# EAGLE design needed-components (EAGLE 6.6.0)
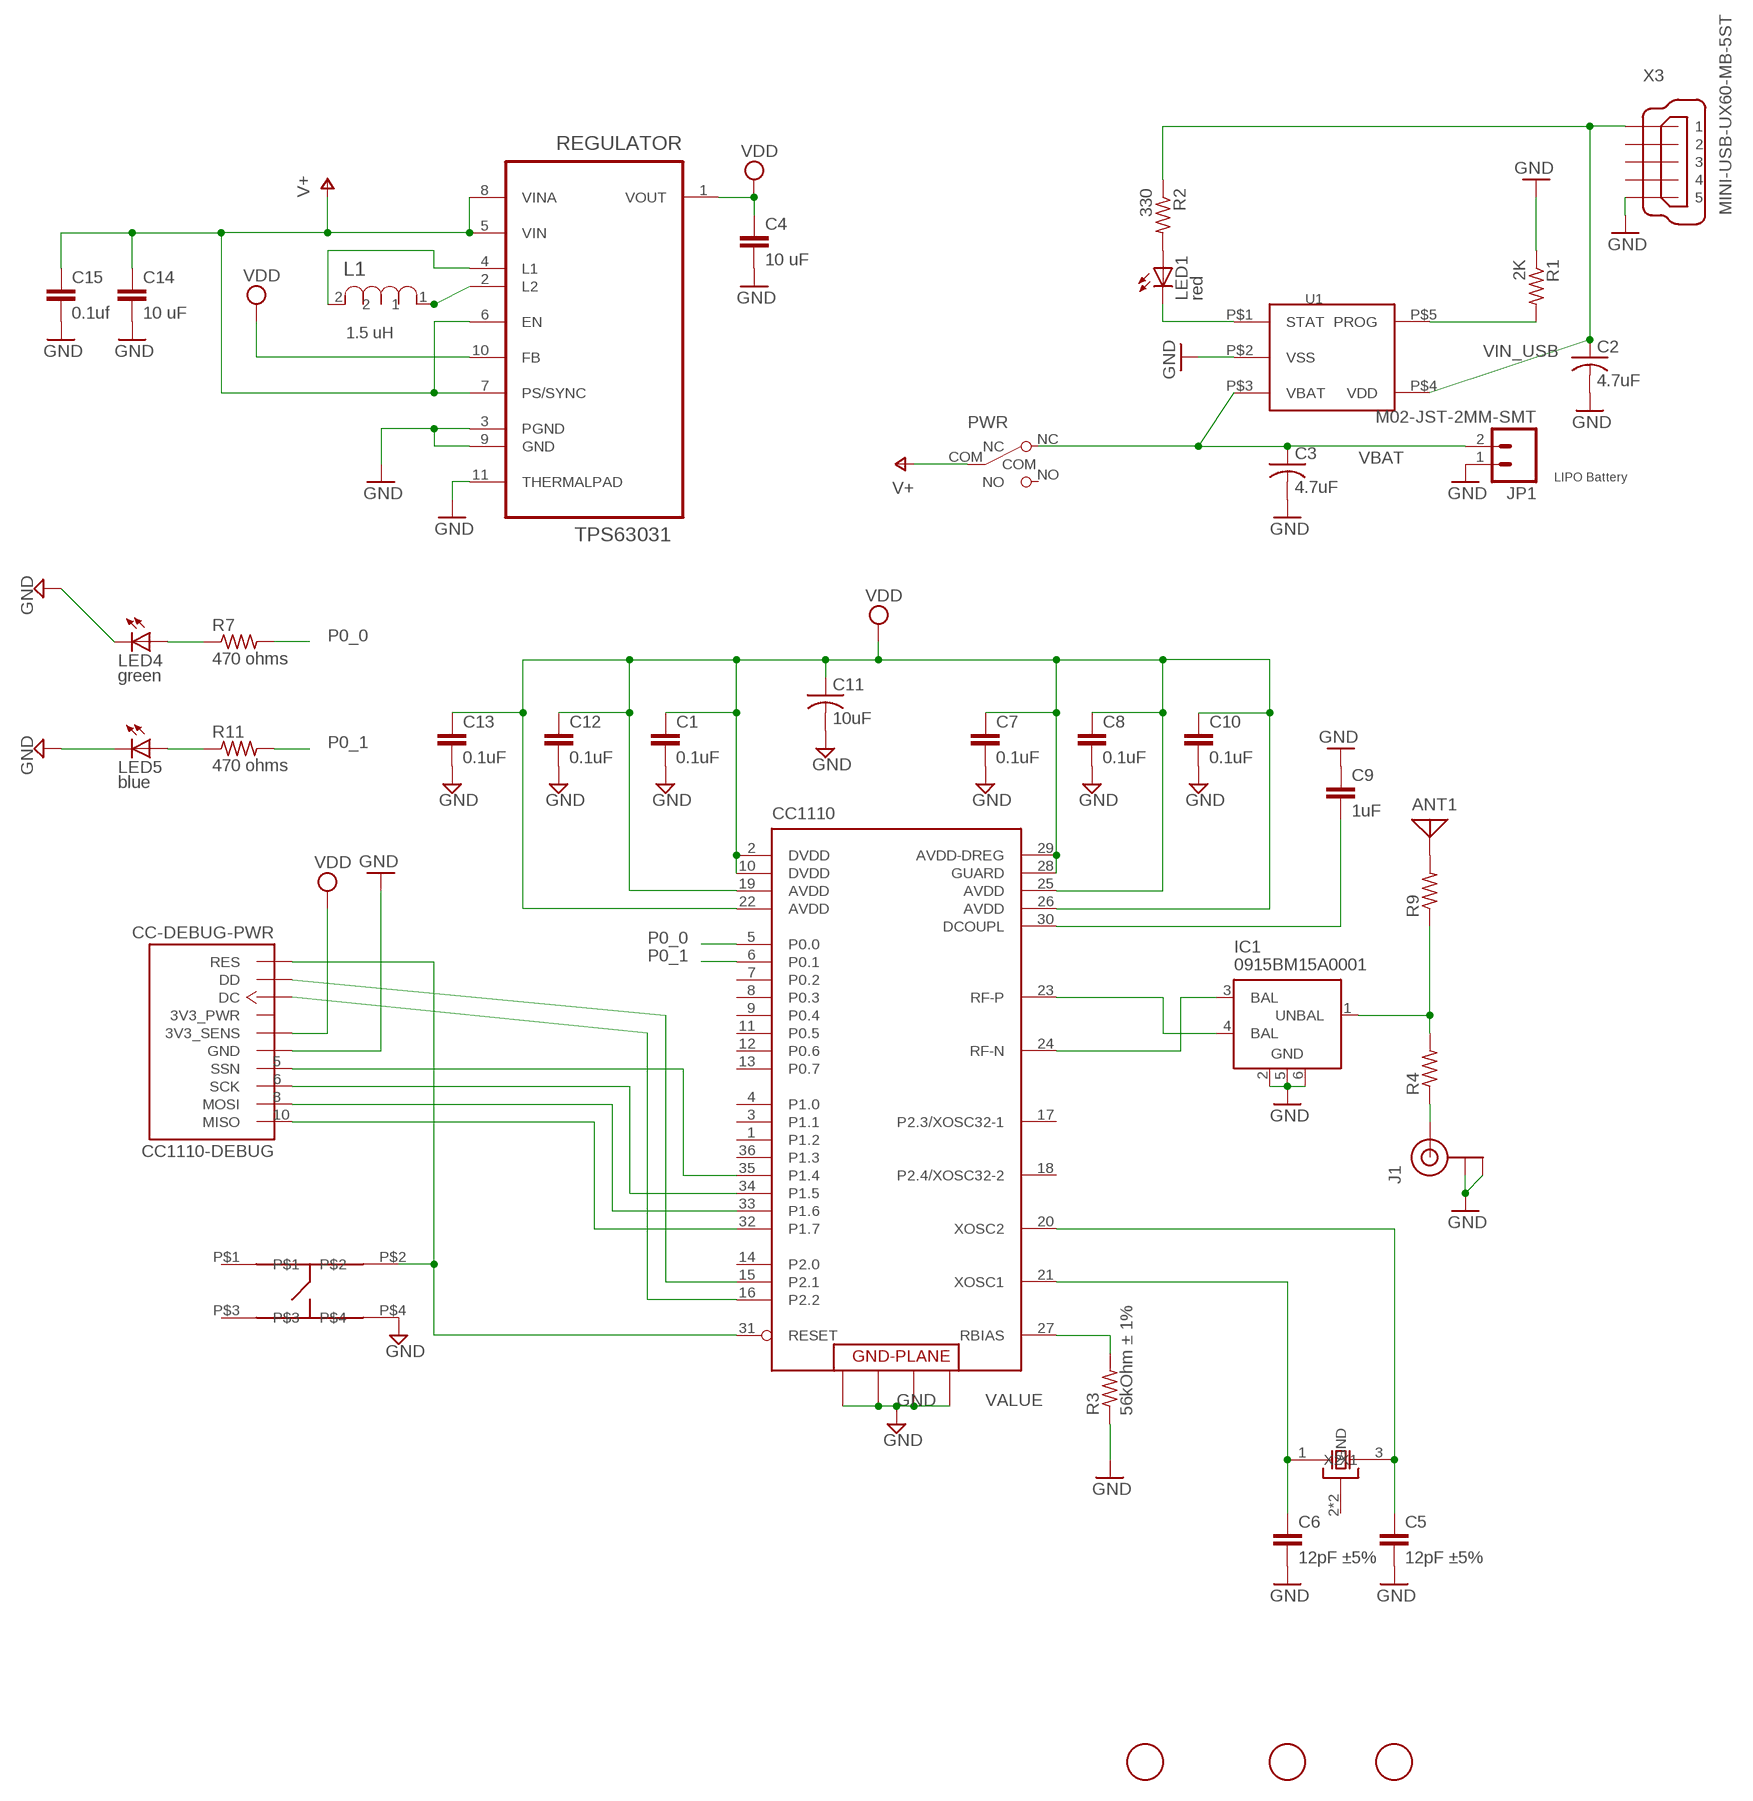
[diagram p0: schematic, sheet 1]

## Parts
ANT1  ANTENNA  [PAD-01]
C1  0.1uF  C-EUC0402  [C0402]
C2  4.7uF  C-USC0603K  [C0603K]
C3  4.7uF  C-USC0603K  [C0603K]
C4  10 uF  C-EUC0805K  [C0805K]
C5  12pF ±5%  C-EUC0402K  [C0402K]
C6  12pF ±5%  C-EUC0402K  [C0402K]
C7  0.1uF  C-EUC0402  [C0402]
C8  0.1uF  C-EUC0402  [C0402]
C9  1uF  C-EUC0402K  [C0402K]
C10  0.1uF  C-EUC0402  [C0402]
C11  10uF  C-USC0805K  [C0805K]
C12  0.1uF  C-EUC0402  [C0402]
C13  0.1uF  C-EUC0402  [C0402]
C14  10 uF  C-EUC0603  [C0603]
C15  0.1uf  C-EUC0402  [C0402]
CC1110  CC1110  [QLP-36_UPDATE]
CC1110-DEBUG  CC-DEBUG-PWR  [CC-P05]
FID1  FIDUCIAL  [FIDUCIAL_1MM]
FID2  FIDUCIAL  [FIDUCIAL_1MM]
FID3  FIDUCIAL  [FIDUCIAL_1MM]
IC1  0915BM15A0001  [0915BM15A0001]
J1  U.FL  [U.FL]
JP1  M02-JST-2MM-SMT  [JST-2-SMD]
L1  1.5 uH  PM0603-R12J-RC  [INDC1610X12N]
LED1  red  LEDSML0603  [SML0603]
LED4  green  LEDSML0603  [SML0603]
LED5  blue  LEDSML0603  [SML0603]
PWR  SW_SLIDE  [SLIDE_SWITCH_SMD]
R1  2K  R-US_R0402  [R0402]
R2  330  R-US_R0402  [R0402]
R3  56kOhm ± 1%  R-US_R0402  [R0402]
R4  R-US_R0402  [R0402]
R7  470 ohms  R-US_R0402  [R0402]
R9  R-US_R0402  [R0402]
R11  470 ohms  R-US_R0402  [R0402]
REGULATOR  TPS63031  [SON50P260X260X80-11N]
U1  MCP73831  [5PIN_SOT23]
U$2  TACTILE_SWITCH  [PTS540]
X1  24MHz 8pF 10ppm -20C +70C  CTS_32X25_SMD  [CTS_32X25]
X3  MINI-USB-UX60-MB-5ST  [UX60-MB-5ST]

## Nets
DC: CC1110-DEBUG.3(DC) CC1110.16(P2.2)
DD: CC1110-DEBUG.4(DD) CC1110.15(P2.1)
GND: C1.2 C2.2 C3.2 C4.2 C5.2 C6.2 C7.2 C8.2 C9.1 C10.2 C11.2 C12.2 C13.2 C14.2 C15.2 CC1110-DEBUG.1(GND) CC1110.37(GND) CC1110.38(GND) CC1110.39(GND) CC1110.40(GND) IC1.2(GND) IC1.5(GND) IC1.6(GND) J1.P$1(GND) J1.P$2(GND) JP1.1 LED4.C LED5.C R1.1 R3.1 REGULATOR.3(PGND) REGULATOR.9(GND) REGULATOR.11(THERMALPAD) U1.P$2(VSS) U$2.P$4 X3.5
MISO: CC1110-DEBUG.10(MISO) CC1110.32(P1.7)
MOSI: CC1110-DEBUG.8(MOSI) CC1110.33(P1.6)
N$1: L1.1 REGULATOR.2(L2)
N$2: LED1.C U1.P$1(STAT)
N$3: R1.2 U1.P$5(PROG)
N$4: LED1.A R2.2
N$5: CC1110.24(RF-N) IC1.3(BAL)
N$6: L1.2 REGULATOR.4(L1)
N$7: CC1110.23(RF-P) IC1.4(BAL)
N$9: J1.P$3(SIGNAL) R4.1
N$10: IC1.1(UNBAL) R4.2 R9.1
N$12: ANT1.1 R9.2
N$14: CC1110.27(RBIAS) R3.2
N$18: C9.2 CC1110.30(DCOUPL)
N$20: C6.1 CC1110.21(XOSC1) X1.1(X1)
N$21: C5.1 CC1110.20(XOSC2) X1.3(X2)
N$24: LED4.A R7.1
N$25: LED5.A R11.1
P0_0: CC1110.5(P0.0) R7.2
P0_1: CC1110.6(P0.1) R11.2
RESET: CC1110-DEBUG.7(RES) CC1110.31(RESET) U$2.P$2
SCK: CC1110-DEBUG.6(SCK) CC1110.34(P1.5)
SSN: CC1110-DEBUG.5(SSN) CC1110.35(P1.4)
V+: C14.1 C15.1 PWR.COM REGULATOR.5(VIN) REGULATOR.6(EN) REGULATOR.7(PS/SYNC) REGULATOR.8(VINA)
VBAT: C3.1 JP1.2 PWR.NC U1.P$3(VBAT)
VDD: C1.1 C4.1 C7.1 C8.1 C10.1 C11.1 C12.1 C13.1 CC1110-DEBUG.2(3V3_SENS) CC1110.2(DVDD) CC1110.10(DVDD) CC1110.19(AVDD) CC1110.22(AVDD) CC1110.25(AVDD) CC1110.26(AVDD) CC1110.28(GUARD) CC1110.29(AVDD-DREG) REGULATOR.1(VOUT) REGULATOR.10(FB)
VIN_USB: C2.1 R2.1 U1.P$4(VDD) X3.1
Unconnected: CC1110-DEBUG.9(3V3_PWR) CC1110.1(P1.2) CC1110.3(P1.1) CC1110.4(P1.0) CC1110.7(P0.2) CC1110.8(P0.3) CC1110.9(P0.4) CC1110.11(P0.5) CC1110.12(P0.6) CC1110.13(P0.7) CC1110.14(P2.0) CC1110.17(P2.3/XOSC32-1) CC1110.18(P2.4/XOSC32-2) CC1110.36(P1.3) PWR.NO U$2.P$1 U$2.P$3 X3.2 X3.3 X3.4

## Notes on the sheet
- LIPO Battery

## Power pins joined to a net without a drawn wire
GND: X1.2(GND) X1.4(GND)

## Library data of the parts
ANT1 = discrete:ANTENNA: Antenna
C1 C4-C10 C12-C15 = rcl:C-EU: CAPACITOR
C2 C3 C11 = rcl:C-US: CAPACITOR, American symbol
CC1110 = board:CC1110: True System-on-Chip with Low Power RF Transceiver and 8051 MCU
CC1110-DEBUG = parts:CC-DEBUG-PWR: CC debugger connection with various form factors. 2x5-pin 0.05" pitch header include Pin 9 (VDD) supply connection as separate pin. https://github.com/jrowberg/sf-oshw Last updated 2014-01-04 by Jeff Rowberg <jeff@rowberg.net>
FID1-FID3 = adafruit:FIDUCIAL: For use by pick and place machines to calibrate the vision/machine, 1mm By microbuilder.eu
IC1 = parts:0915BM15A0001: 915 MHz Impedance Matched Balun-Filter For TI CC11xx Chipset family Data sheet <http://www.johansontechnology.com/datasheets/chipset-specific/0915BM15A0001.pdf>
J1 = SparkFun-Connectors:U.FL: SMD antenna connector- WRL-09144; PROD_ID: CONN-09193
JP1 = SparkFun-Connectors:M02: Standard 2-pin 0.1" header. Use with - straight break away headers ( PRT-00116) - right angle break away headers (PRT-00553) - swiss pins (PRT-00743) - machine pins (PRT-00117) - female headers (PRT-00115) Molex polarized connector foot print use with: PRT-08233 with associated crimp pins and housings. 2.54_SCREWTERM for use with PRT-10571. 3.5mm Screw Terminal footprints for PRT-08084 5mm Screw Terminal footprints for use with PRT-08432; PROD_ID: CONN-08352
L1 = Bourns_By_element14_Batch_1:PM0603-R12J-RC: CHIP INDUCTOR, 120NH, 300MA, 5%, 1300MHZ; MPN: MLF1608A1R5KTD25; SUPPLIER: Mouser; TOLERANCE: ±5 %; VALUE: 120 nH
LED1 LED4 LED5 = led:LED: LED OSRAM: - CHIPLED LG R971, LG N971, LY N971, LG Q971, LY Q971, LO R971, LY R971 LH N974, LH R974 LS Q976, LO Q976, LY Q976 LO Q996 - Hyper CHIPLED LW Q18S LB Q993, LB Q99A, LB R99A - SideLED LS A670, LO A670, LY A670, LG A670, LP A670 LB A673, LV A673, LT A673, LW A673 LH A674 LY A675 LS A676, LA A676, LO A676, LY A676, LW A676 LS A679, LY A679, LG A679 - Hyper Micro SIDELED® LS Y876, LA Y876, LO Y876, LY Y876 LT Y87S - SmartLED LW L88C, LW L88S LB L89C, LB L89S, LG L890 LS L89K, LO L89K, LY L89K LS L896, LA L896, LO L896, LY L896 - TOPLED LS T670, LO T670, LY T670, LG T670, LP T670 LSG T670, LSP T670, LSY T670, LOP T670, LYG T670 LG T671, LOG T671, LSG T671 LB T673, LV T673, LT T673, LW T673 LH T674 LS T676, LA T676, LO T676, LY T676, LB T676, LH T676, LSB T676, LW T676 LB T67C, LV T67C, LT T67C, LS T67K, LO T67K, LY T67K, LW E67C LS E67B, LA E67B, LO E67B, LY E67B, LB E67C, LV E67C, LT E67C LW T67C LS T679, LY T679, LG T679 LS T770, LO T770, LY T770, LG T770, LP T770 LB T773, LV T773, LT T773, LW T773 LH T774 LS E675, LA E675, LY E675, LS T675 LS T776, LA T776, LO T776, LY T776, LB T776 LHGB T686 LT T68C, LB T68C - Hyper Mini TOPLED® LB M676 - Mini TOPLED Santana® LG M470 LS M47K, LO M47K, LY M47K Source: http://www.osram.convergy.de LUXEON: - LUMILED® LXK2-PW12-R00, LXK2-PW12-S00, LXK2-PW14-U00, LXK2-PW14-V00 LXK2-PM12-R00, LXK2-PM12-S00, LXK2-PM14-U00 LXK2-PE12-Q00, LXK2-PE12-R00, LXK2-PE12-S00, LXK2-PE14-T00, LXK2-PE14-U00 LXK2-PB12-K00, LXK2-PB12-L00, LXK2-PB12-M00, LXK2-PB14-N00, LXK2-PB14-P00, LXK2-PB14-Q00 LXK2-PR12-L00, LXK2-PR12-M00, LXK2-PR14-Q00, LXK2-PR14-R00 LXK2-PD12-Q00, LXK2-PD12-R00, LXK2-PD12-S00 LXK2-PH12-R00, LXK2-PH12-S00 LXK2-PL12-P00, LXK2-PL12-Q00, LXK2-PL12-R00 Source: www.luxeon.com KINGBRIGHT: KA-3528ASYC Source: www.kingbright.com
PWR = parts:SW_SLIDE
R1-R4 R7 R9 R11 = rcl:R-US_: RESISTOR
REGULATOR = board:TPS63031: HIGH EFFICIENCY SINGLE INDUCTOR BUCK-BOOST CONVERTER WITH 1-A SWITCHES; MPN: TPS63031; OC_FARNELL: 1686303; OC_NEWARK: 19P7478; PACKAGE: SON-10; SUPPLIER: Texas Instruments
U1 = parts:MCP73831: Digikey No:- __MCP73831T-2ACI/OTCT-ND__
U$2 = parts:TACTILE_SWITCH: Ultra Low Profile SMT Top Actuated PTS540 JM035 SMTR LFS Datasheet <http://www.mouser.com/ds/2/60/PTS540_9sept14-372441.pdf>
X1 = cts_crystal:CTS_32X25_SMD
X3 = con-hirose:MINI-USB-: MINI USB Connector Source: http://www.hirose.co.jp/cataloge_hp/e24000019.pdf; OC_FARNELL: unknown; OC_NEWARK: unknown

## Board
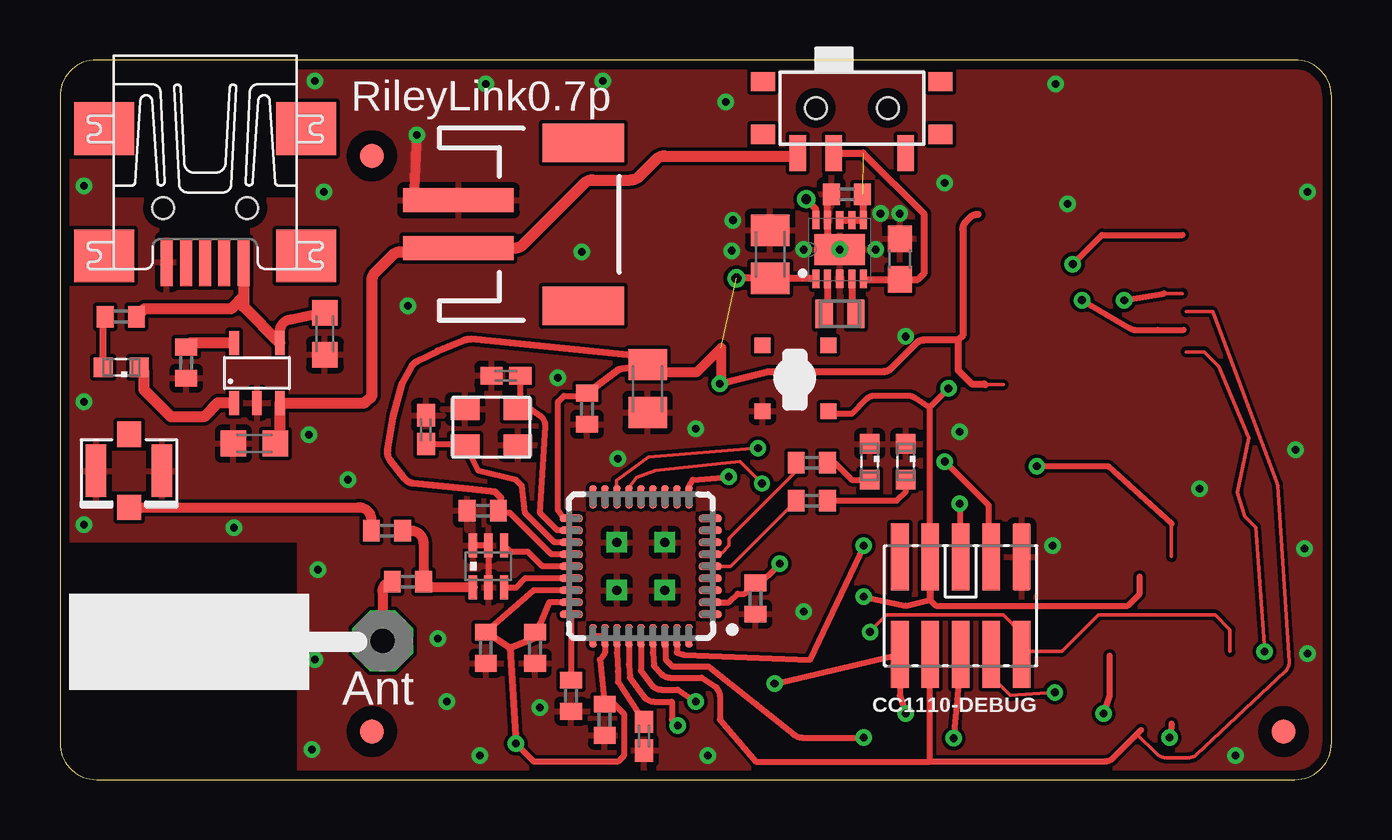
[diagram p1: board, top side]
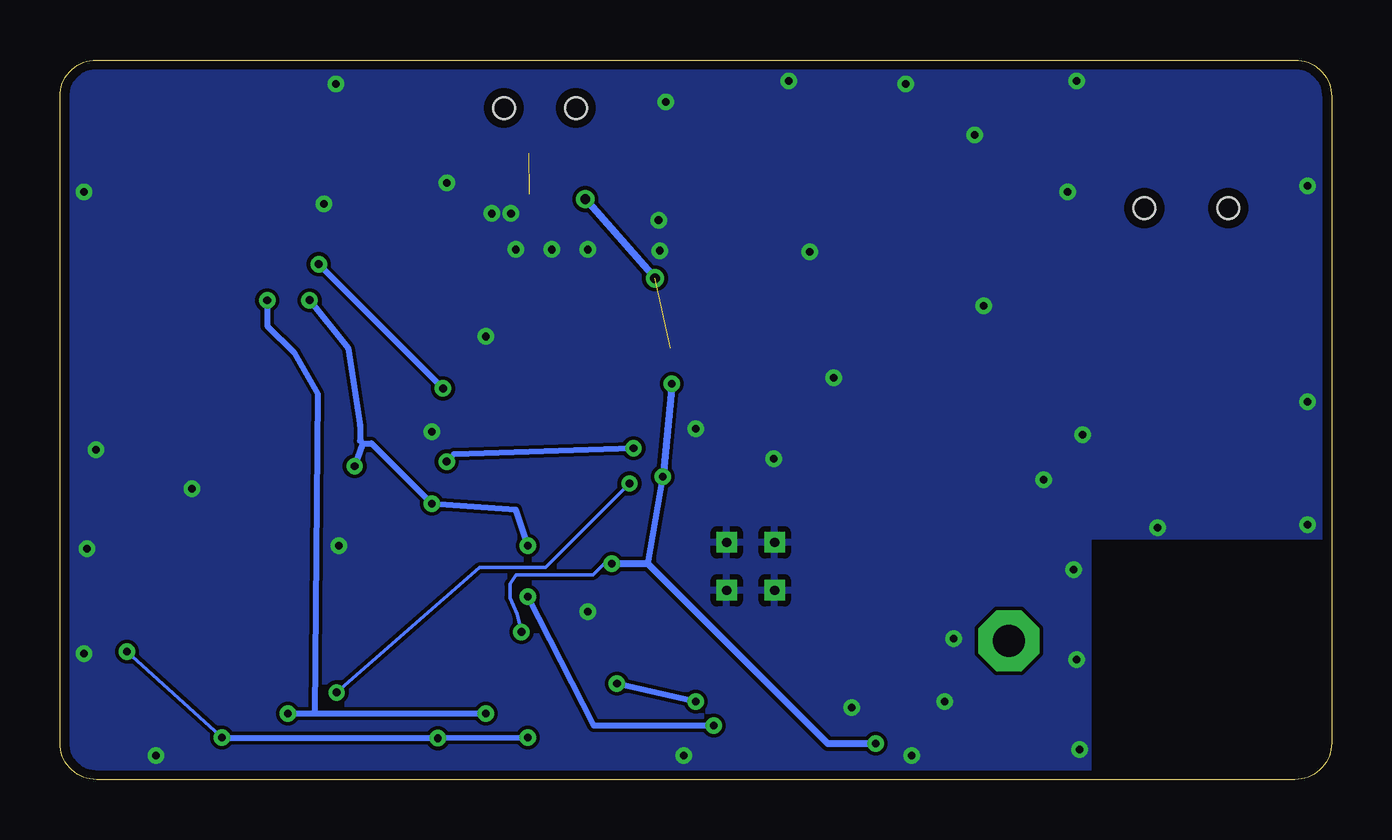
[diagram p2: board, bottom side, seen from below]

Size 53 x 30 mm. Coordinates in mm from the lower left corner, seen from the top.
Outline: 0,28.48 0,1.52 arc90 1.52,0 51.48,0 arc90 53,1.52 53,28.48 arc90 51.48,30 1.52,30 arc90 0,28.48
Copper layers (1*16): Top 0.0356mm / dielectric 1.5011mm / Bottom 0.0356mm
Design rules "oshpark *": minimum track width 6mil, minimum drill 13mil, track to track 6mil, track to pad 6mil, pad to pad 6mil, via to via 6mil, smd to smd 6mil, copper to edge 15mil, drill to drill 6mil, minimum pad ring 7mil, minimum via ring 7mil, stop-mask expansion 3mil, vias tented up to drill 21mil, thermal gap 10mil
bRestrict: area 0,0 to 10,10

### Footprints (pad centres in the part's own frame; a part is rotated, then mirrored left to right if it is on the bottom)
PAD-01 = drill 1.321 pad 2.54 octagon: 1 0,0
C0402 = smd 0.7 x 0.9: 1 -0.65,0; 2 0.65,0
C0603K = smd 1.05 x 1.08: 1 -0.875,0; 2 0.875,0
C0805K = smd 1.3 x 1.6: 1 -1,0; 2 1,0
C0402K = smd 0.925 x 0.74: 1 -0.6,0; 2 0.6,0
C0603 = smd 1.1 x 1: 1 -0.85,0; 2 0.85,0
QLP-36_UPDATE = smd 0.95 x 0.3: 1 -2.9,2; 2 -2.9,1.5; 3 -2.9,1; 4 -2.9,0.5; 5 -2.9,0; 6 -2.9,-0.5; 7 -2.9,-1; 8 -2.9,-1.5; 9 -2.9,-2; 19 2.9,-2; 20 2.9,-1.5; 21 2.9,-1; 22 2.9,-0.5; 23 2.9,0; 24 2.9,0.5; 25 2.9,1; 26 2.9,1.5; 27 2.9,2 | smd 0.3 x 0.95: 10 -2,-2.9; 11 -1.5,-2.9; 12 -1,-2.9; 13 -0.5,-2.9; 14 0,-2.9; 15 0.5,-2.9; 16 1,-2.9; 17 1.5,-2.9; 18 2,-2.9; 28 2,2.9; 29 1.5,2.9; 30 1,2.9; 31 0.5,2.9; 32 0,2.9; 33 -0.5,2.9; 34 -1,2.9; 35 -1.5,2.9; 36 -2,2.9 | drill 0.381 pad 0.85 square: 37 -1,1; 38 1,1; 39 -1,-1; 40 1,-1
CC-P05 = smd 0.74 x 2.8: 1 -2.54,-2.03; 2 -2.54,2.03; 3 -1.27,-2.03; 4 -1.27,2.03; 5 0,-2.03; 6 0,2.03; 7 1.27,-2.03; 8 1.27,2.03; 9 2.54,-2.03; 10 2.54,2.03
FIDUCIAL_1MM = smd 1 x 1: 1 0,0
0915BM15A0001 = smd 0.35 x 1: 1 -0.65,-0.875; 2 0,-0.875; 3 0.65,-0.875; 4 0.65,0.875; 5 0,0.875; 6 -0.65,0.875
U.FL = smd 2.2 x 0.85: P$1 0,1.375; P$2 0,-1.375 | smd 1.05 x 1: P$3 1.525,0; P$4 -1.525,0
JST-2-SMD = smd 1 x 4.6: 1 -1,-3.7; 2 1,-3.7 | smd 1.6 x 3.4: NC1 -3.4,1.5; NC2 3.4,1.5
INDC1610X12N = smd 0.711 x 1.194: 1 -0.66,0; 2 0.66,0
SML0603 = smd 0.8 x 0.8: A 0.75,0; C -0.75,0
SLIDE_SWITCH_SMD = smd 0.7 x 1.5: COM 0.75,1.875; NC 2.25,1.875; NO -2.25,1.875 | smd 1 x 0.8: P$1 -3.7,-1.1; P$2 -3.7,1.1; P$3 3.7,1.1; P$4 3.7,-1.1 | hole 0.9: -1.5,0; 1.5,0
R0402 = smd 0.7 x 0.9: 1 -0.65,0; 2 0.65,0
SON50P260X260X80-11N = smd 0.762 x 0.305: 1 -1.219,0.991; 2 -1.219,0.508; 3 -1.219,0; 4 -1.219,-0.508; 5 -1.219,-0.991; 6 1.219,-0.991; 7 1.219,-0.508; 8 1.219,0; 9 1.219,0.508; 10 1.219,0.991 | smd 1.295 x 2.108: 11 0,0
5PIN_SOT23 = smd 0.4 x 1: P$1 0.4,-0.63; P$2 1.35,-0.63; P$3 2.3,-0.63; P$4 2.3,1.87; P$5 0.4,1.87
PTS540 = smd 0.65 x 0.65: P$1 -1.375,1.375; P$2 1.375,1.375; P$3 -1.375,-1.375; P$4 1.375,-1.375
CTS_32X25 = smd 1.2 x 0.9: 1 -1.1,-0.7; 2 1.1,-0.7; 3 1.1,0.8; 4 -1.1,0.8
UX60-MB-5ST = smd 2 x 0.5: 1 2.25,1.6; 2 2.25,0.8; 3 2.25,0; 4 2.25,-0.8; 5 2.25,-1.6 | smd 2.2 x 2.5: M1 -3.3,-4.2; M2 -3.3,4.2; M3 2,4.2; M4 2,-4.2 | hole 0.9: 0,-1.75; 0,1.75

### Placement (x,y rotation side)
ANT1  13.45,5.78 0 top
C1  28.99,7.55 270 top
C2  11.04,18.59 270 top
C3  8.1,14.01 180 top
C4  29.6,21.9 90 top
C5  18.59,16.84 180 top
C6  15.26,14.59 90 top
C7  22.7,2.5 270 top
C8  17.75,5.5 270 top
C9  24.34,1.81 90 top
C10  19.8,5.5 270 top
C11  24.5,16.3 270 top
C12  21.97,15.46 270 top
C13  17.62,11.21 180 top
C14  35,21.7 90 top
C15  32.8,24.4 180 top
CC1110  24.21,8.89 180 top
CC1110-DEBUG  37.55,7.25 180 top
FID1  13,2 0 top
FID2  13,26 0 top
FID3  51,2 0 top
IC1  17.86,8.89 0 top
J1  2.88,12.88 270 top
JP1  20.31,23.15 270 top
L1  32.52,19.42 0 top
LED1  2.55,17.19 180 top
LED4  35.25,13.25 270 top
LED5  33.75,13.25 270 top
PWR  33,28 180 top
R1  5.26,17.38 90 top
R2  2.54,19.3 180 top
R3  21.3,3.5 90 top
R4  13.62,10.38 0 top
R7  31.34,11.63 180 top
R9  14.5,8.25 180 top
R11  31.34,13.21 180 top
REGULATOR  32.5,22.1 90 top
U1  6.86,16.33 0 top
U$2  30.66,16.73 270 top
X1  17.98,14.64 0 top
X3  6.05,23.83 270 top

### Tracks (layer width: path | path; a pad name or v marks a point on that pad's centre or on a via)
DC  (via drill 0.33)
  Top 0.152: v29.09,13.81 24.54,13.44 23.19,12.47 23.19,12.14 CC1110.16 | 38.71,9.3 CC1110-DEBUG.3
  Top 0.24: v36.88,13.26 38.71,11.43 38.71,9.3
  Bottom 0.152: v36.88,13.26 36.58,13.56
  Bottom 0.24: 36.58,13.56 v29.09,13.81
DD  (via drill 0.33)
  Top 0.152: v29.26,12.34 28.35,13.26 24.81,12.88 24.02,12.59 23.77,12.26 CC1110.15 | v41.47,3.63 39.62,3.5 38.86,4.27 38.86,5.18 CC1110-DEBUG.4
  Bottom 0.152: v29.26,12.34 32.77,8.84 35.51,8.84 v41.47,3.63
GND  (via drill 0.33, 0.33 pad 0.41)
  Top 0.26: C10.2 20,5 | IC1.2 IC1.5 IC1.6
  Top 0.3: REGULATOR.11 31.99,22.1 REGULATOR.9 31.99,24.4 C15.2
  Top 0.406: JP1.1 14.75,24.15 v14.88,26.88
  other vias: 10.75,8.75 11,24.5 28,22.05 27.75,28.25 34,22.1 52,24.5 21.75,22 51.88,9.62 52,5.25 51.5,13.75 49,1 41.38,9.75 20.75,16.75 10.38,14.38 14.5,19.75 10.62,5 15.75,5.88 17.5,1 12,12.5 41.5,29 42,24 31,7 20,3 27,1 47.5,12.12 37.5,14.5 35.25,18.48 1,10.62 7.25,10.5 1,15.75 1,24.75 36.88,24.88 22.62,29.12 17.75,29 10.62,29.12 10.5,1.25 16.12,3.25 23.25,13.38 26.5,14.62 28.05,23.32 32.5,22.1 31,22.1 34.2,23.6 35,23.6
  pour Bottom: 0,30 53,30 53,0 0,0
  pour Top: 10,0 10,10 0,10 0,30 53,30 53,0
MISO  (via drill 0.33)
  Top 0.152: 46.02,20.27 46.79,20.27
  Top 0.24: CC1110.32 24.21,4.54 24.65,3.95 arc53 25.05,3.75 25.75,3.75 v26.5,3.25 | v29.79,4 CC1110-DEBUG.10 35.01,3.5 v35.25,2.75 | v43.5,2.75 43.75,3.5 43.75,5.17 | v44.36,19.98 46.02,20.27
  Bottom 0.152: 42.37,2.74 42.37,2.75
  Bottom 0.24: v26.5,3.25 v29.79,4 | v35.25,2.75 42.37,2.75 | 42.37,2.75 v43.5,2.75 | 42.37,2.75 42.24,16.05 43.25,17.8
  Bottom 0.254: v44.36,19.98 44.36,18.91 43.25,17.8
MOSI
  Top 0.152: 46.94,19.51 48.05,19.51 50.72,12.38 arc-17 50.75,12.23 51.23,4.91 arc-51 51.07,4.5 47.39,1.05 arc-43 47.04,0.91 46.08,0.91 arc-45 45.72,1.06 44.89,1.89
  Top 0.24: CC1110.33 24.71,5.29 24.75,4.75 25.05,4.42 arc48 25.43,4.25 26.75,4.25 27.27,3.9 arc-56 27.5,3.48 27.5,2.5 29,0.75 36.25,0.75 | 36.25,0.75 36.25,4.45 CC1110-DEBUG.8 | 45.07,2.07 44.89,1.89 43.9,0.9 arc-45 43.54,0.75 36.25,0.75
N$1
  Top 0.24: 31.99,19.56 L1.1
  Top 0.3: REGULATOR.2 31.99,19.56
N$2
  Top 0.45: U1.P$1 6.58,15.7 6,15.12 4.62,15.12 3.5,16.25 3.5,16.99 LED1.C
N$3
  Top 0.45: U1.P$5 5.43,18.2 R1.2
N$4
  Top 0.3: LED1.A 1.8,19.21 R2.2
N$5
  Top 0.26: CC1110.24 19.39,8.39 19,8 18.52,8 IC1.3
N$6
  Top 0.24: REGULATOR.4 33.01,21.09 33,21.1 | 33,19.59 L1.2
  Top 0.3: 33,21.1 33,19.59
N$7
  Top 0.26: CC1110.23 20.11,8.89 19.5,9.5 18.77,9.5 IC1.4
N$9
  Top 0.406: J1.P$3 12.47,11.35 arc-90 12.97,10.84 R4.1
N$10
  Top 0.24: 17.25,7.97 IC1.1 17.2,8
  Top 0.406: IC1.1 15.38,8.02 arc-90 R9.1 15.15,9.87 arc90 14.64,10.38 R4.2
N$12
  Top 0.406: R9.2 arc90 13.45,7.84 ANT1.1
N$14
  Top 0.26: CC1110.27 21.31,5 R3.2
N$18
  Top 0.26: CC1110.30 23.21,5.29 23.25,4.5 23.25,4.07 C9.2
N$20
  Top 0.24: CC1110.21 20.61,9.89 19.38,11.12 19.25,12.25 19,12.5 17.45,12.88 X1.1 16.84,13.98 C6.1
N$21
  Top 0.24: CC1110.20 20.73,10.39 20,11.12 20.23,14.72 arc58 20.02,15.16 19.38,15.62 19,15.62 19.08,15.54 19.18,15.54 | C5.1 19.18,15.54 | 19.18,15.54 X1.3
N$24
  Top 0.24: R7.1 34.88,11.63 35.25,12 LED4.A
N$25
  Top 0.24: R11.1 32.3,13.21 33,12.5 LED5.A
P0_0
  Top 0.152: CC1110.5 27.95,8.89 R7.2
P0_1
  Top 0.152: R11.2 30.63,13.11 30.63,12.8 27.89,10.06 27.89,9.75 27.58,9.45 27.13,9.45 CC1110.6
RESET  (via drill 0.33)
  Top 0.152: 36.27,15.54 36.25,15.5
  Top 0.24: CC1110.31 23.71,4.79 23.75,4.25 24.35,3.45 arc53 24.75,3.25 25.5,3.25 25.5,2.5 v25.75,2.25 | v33.5,7.62 35.25,7.25 36.25,7.5 36.25,8.64 | 36.25,8.64 CC1110-DEBUG.7 36.27,7.47 36.5,7.25 44.5,7.25 45,7.75 45,8.46 | 36.25,8.64 36.25,15.5 35.63,15.91 arc34 35.35,16 33.96,16 arc45 33.6,15.85 33,15.25 32.14,15.25 U$2.P$2 | 46.79,22.71 43.43,22.71 v42.22,21.49 | 36.27,15.54 v37.03,16.31
  Bottom 0.24: v25.75,2.25 30.75,2.25 v33.5,7.62 | v37.03,16.31 v42.22,21.49
SCK  (via drill 0.33)
  Top 0.152: 46.94,17.83 47.7,17.83 48.31,17.22 49.56,14.23 49.07,11.97 49.38,10.97 49.84,10.52 v50.21,5.33
  Top 0.24: 25.21,5.54 CC1110.34 25.25,5.95 25.25,5 25.55,4.7 27.05,4.7 30.61,1.86 arc39 30.93,1.75 v33.5,1.75 | v37.25,1.72 37.5,4.42 CC1110-DEBUG.6 | 46.34,2.34 v46.25,1.75
  Bottom 0.152: v50.21,5.33 46.33,1.83 v46.25,1.75
  Bottom 0.24: v33.5,1.75 v37.25,1.72 37.47,1.75 v46.25,1.75
SSN  (via drill 0.33)
  Top 0.152: 46.33,10.67 46.33,9.3
  Top 0.24: CC1110.35 25.71,5.29 26,5.2 31.25,5 v33.5,9.75 | v37.5,11.5 37.5,8.57 CC1110-DEBUG.5 | 46.33,10.67 43.68,13.06 v40.72,13.06 | v42.6,19.98 44.61,18.8 arc31 44.88,18.74 45.75,18.75 46.83,18.75
  Bottom 0.152: 37.64,11.58 v37.5,11.5
  Bottom 0.24: v33.5,9.75 34,11.25 v37.5,11.5 40.02,14.02 40.39,14.02 | 40.39,14.02 v40.72,13.06 | v42.6,19.98 40.98,17.98 40.5,14.75 40.5,14.13 40.39,14.02
V+  (1 unrouted)
  Top 0.3: REGULATOR.5 33.49,20.85 C14.1 35.75,20.85 36,21.1 36,23.6 33.48,26.12 PWR.COM | REGULATOR.8 REGULATOR.7 REGULATOR.6 33.49,24.4 C15.1
VBAT
  Top 0.3: 30.62,26 PWR.NC
  Top 0.45: C3.1 9.16,14.19 U1.P$3 12.7,15.7 13,16 13,20.79 arc-45 13.15,21.15 13.85,21.85 arc-45 14.21,22 16.46,22 JP1.2 18.94,22.15 arc45 19.3,22.3 21.85,24.85 arc-45 22.21,25 23.79,25 arc45 24.15,25.15 24.85,25.85 arc-45 25.21,26 30.62,26
VDD  (via drill 0.33, 0.41)  (1 unrouted)
  Top 0.152: 48.77,5.33 48.77,6.25 48.16,6.86 43.28,6.86 41.76,5.33 40.23,5.33 CC1110-DEBUG.2 40.08,5.33 40.08,6.1 39.32,6.86 34.44,6.86 34.14,6.55 v33.76,6.15 | 38.56,16.46 39.32,16.46
  Top 0.24: v30,9 28.95,7.95 C1.1 28.54,7.75 28.25,7.75 27.89,7.39 CC1110.2 | 23.5,2.75 23.5,1 23.25,0.75 19.75,0.75 v19,1.5 | CC1110.10 26.21,12.21 26.38,12.5 v27.88,12.62 | CC1110.19 21.02,10.89 20.75,11.25 20.75,15.75 21,16 21.86,16 | CC1110.22 20.48,9.39 18.75,11.12 18.36,11.12 | 18.36,11.12 C13.1 | 18.38,11.75 18.38,11.25 18.36,11.23 18.36,11.12
  Top 0.26: CC1110.25 19.74,7.89 C8.1 18,6 | CC1110.26 20.39,7.39 20,6.5 C10.1 20,6 | CC1110.28 CC1110.29 22.71,5.29 22.5,5 C7.1 23,3.25 23.5,2.75
  Top 0.3: 18,6 18.75,5.5 | 20,6 18.75,5.5 | 18.75,5.5 v19,1.5 | 18.38,11.75 18.12,12 17,12.12 14.72,12.35 arc-46 14.37,12.55 13.76,13.33 arc-47 13.66,13.72 13.88,15.12 14.25,16.5 14.67,17.24 arc-34 14.89,17.44 15.75,17.88 16.88,18.33 arc-28 17.13,18.36 24.49,17.62 24.5,17.62 C11.1 | 37.44,18.32 36.03,18.32 arc45 35.67,18.18 34.65,17.15 arc-45 34.29,17 29.5,17 v27.5,16.5 27.54,16.46 27.55,16.46 | 37.44,18.32 37.44,17.06 38,16.5 38.52,16.5 38.56,16.46 | 38.27,23.56 arc45 37.91,23.41 37.77,23.27 arc45 37.62,22.91 37.62,18.51 37.44,18.32 | C11.1 23.3,17.11 C12.1 21.86,16 | 24.8,17 C11.1 | REGULATOR.1 29.5,20.88 C4.1 v28.2,20.9 | REGULATOR.10 31.51,23.79 v31.1,24.2
  Top 0.406: 27.55,16.46 27.55,18 26.55,17 24.8,17
  Bottom 0.152: v33.76,6.15 33.94,6.9 34.25,7.58 34.25,8.15 33.98,8.53 30.79,8.53 30.33,8.99 30.02,8.99 v30,9
  Bottom 0.26: 28.5,9 v27.88,12.62
  Bottom 0.3: v19,1.5 21,1.5 28.5,9 v30,9 | v27.5,16.5 v27.88,12.62 | v28.2,20.9 v31.1,24.2
VIN_USB
  Top 0.406: C2.1 9.67,19.18 arc90 9.16,18.68 U1.P$4
  Top 0.45: U1.P$4 7.65,19.71 X3.1 7.65,20.15 7.12,19.62 3.52,19.62 R2.1

### Text on the board
tNames: RileyLink0.7p | Ant